# EAGLE design fat2 (EAGLE 6.1)
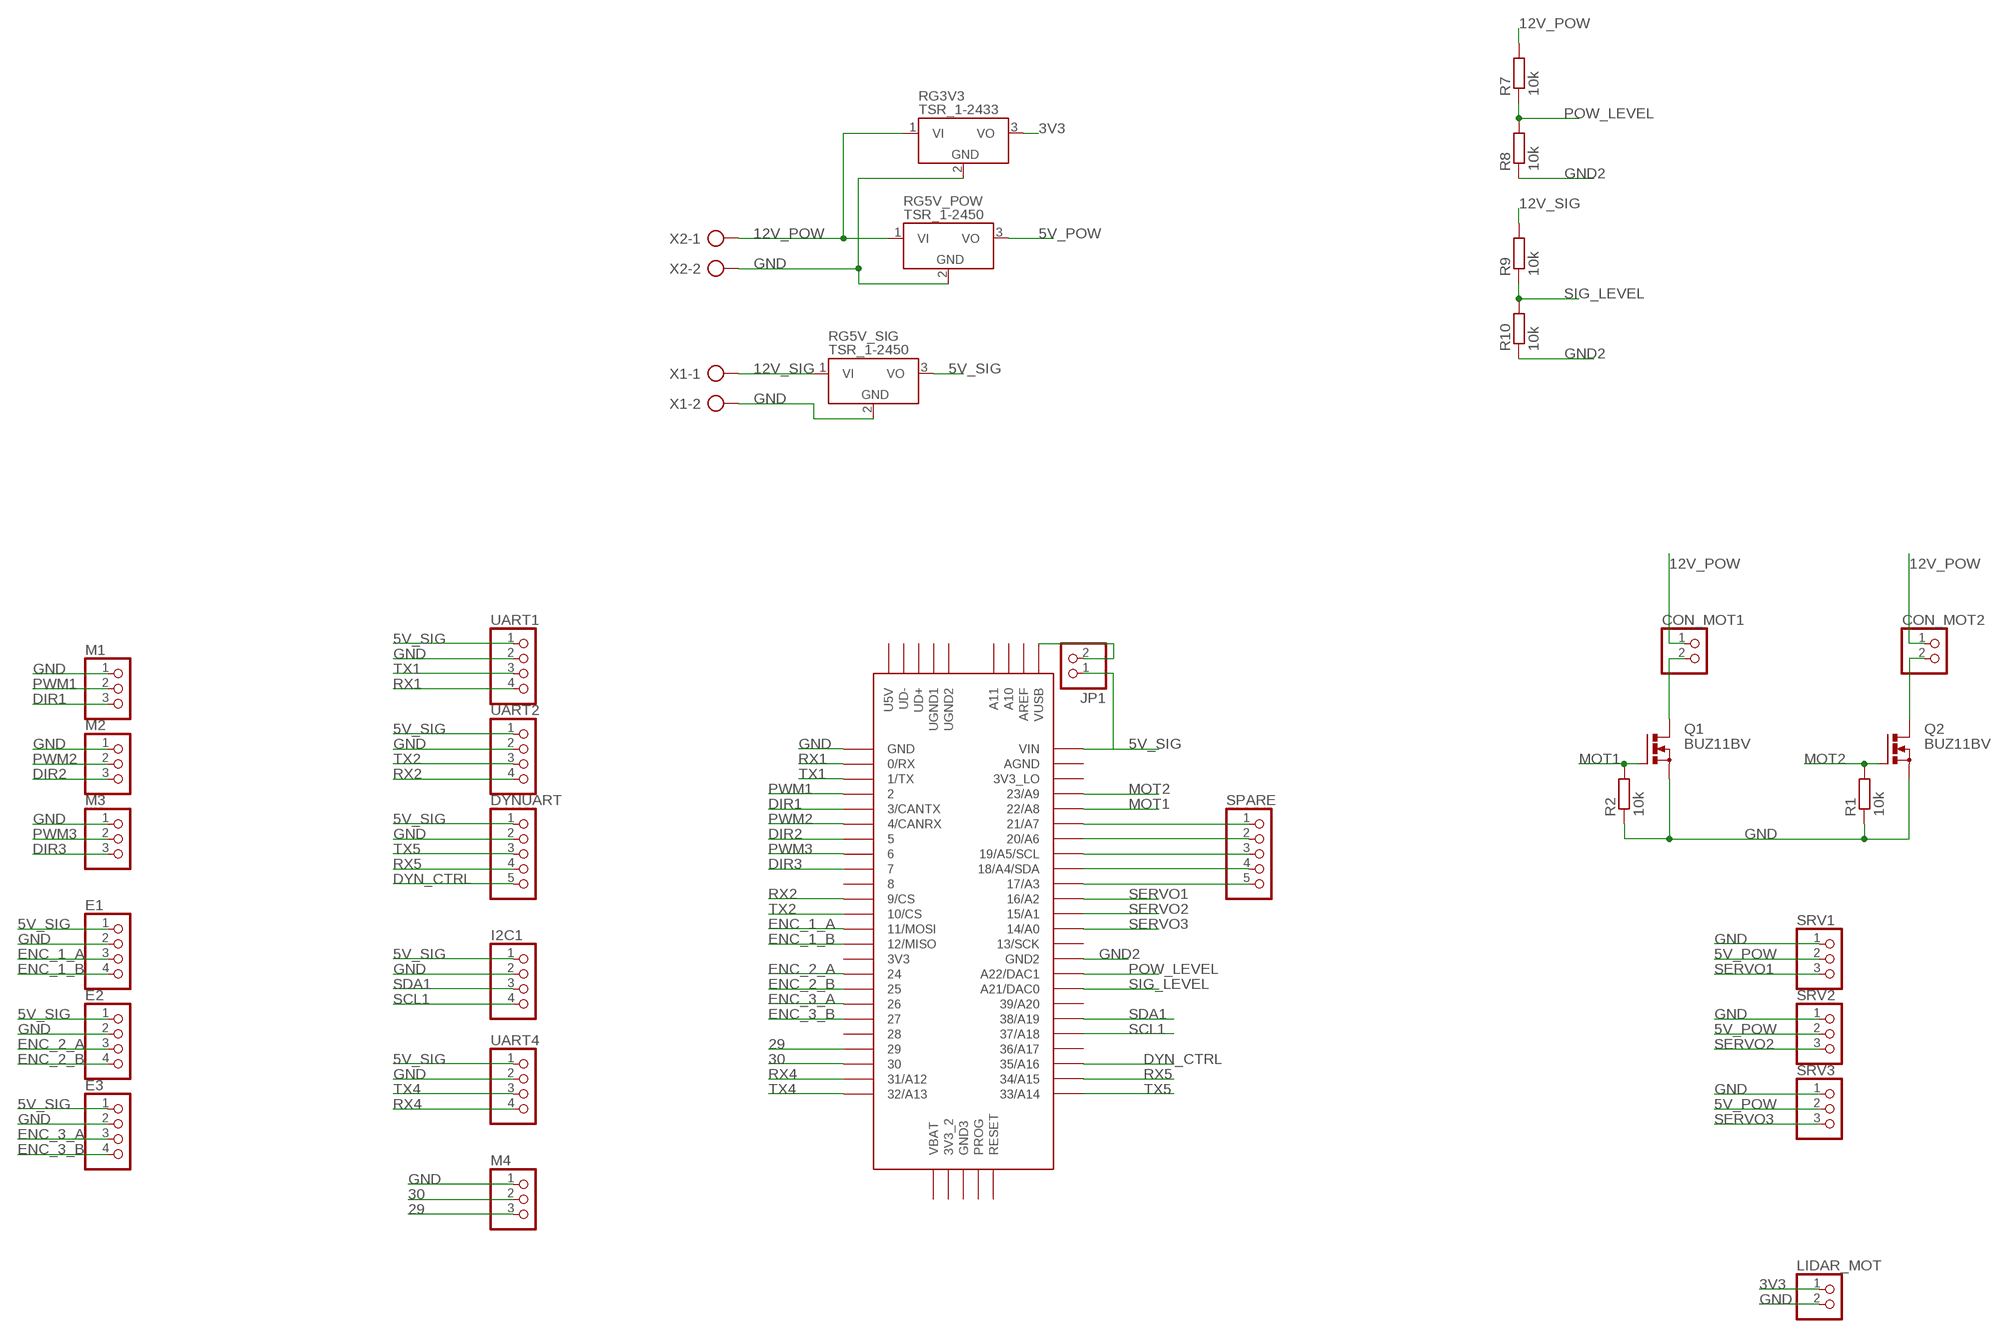
[diagram p0: schematic, sheet 1]

## Parts
CON_MOT1  PINHD-1X2  [1X02]
CON_MOT2  PINHD-1X2  [1X02]
DYNUART  PINHD-1X5  [1X05]
E1  PINHD-1X4  [1X04]
E2  PINHD-1X4  [1X04]
E3  PINHD-1X4  [1X04]
I2C1  PINHD-1X4  [1X04]
JP1  PINHD-1X2/90  [1X02/90]
LIDAR_MOT  PINHD-1X2  [1X02]
M1  PINHD-1X3  [1X03]
M2  PINHD-1X3  [1X03]
M3  PINHD-1X3  [1X03]
M4  PINHD-1X3  [1X03]
Q1  BUZ11BV  [TO220BV]
Q2  BUZ11BV  [TO220BV]
R1  10k  R-EU_0204/7  [0204/7]
R2  10k  R-EU_0204/7  [0204/7]
R7  10k  R-EU_0204/7  [0204/7]
R8  10k  R-EU_0204/7  [0204/7]
R9  10k  R-EU_0204/7  [0204/7]
R10  10k  R-EU_0204/7  [0204/7]
RG3V3  TSR_1-2433  [TSR-1]
RG5V_POW  TSR_1-2450  [TSR-1]
RG5V_SIG  TSR_1-2450  [TSR-1]
SPARE  PINHD-1X5  [1X05]
SRV1  PINHD-1X3  [1X03]
SRV2  PINHD-1X3  [1X03]
SRV3  PINHD-1X3  [1X03]
U$1  TEENSY_3.5/3.6  [TEENSY_3.5/3.6]
UART1  PINHD-1X4  [1X04]
UART2  PINHD-1X4  [1X04]
UART4  PINHD-1X4  [1X04]
X1  AK300/2  [AK300/2]
X2  AK300/2  [AK300/2]

## Nets
3V3: LIDAR_MOT.1 RG3V3.3(VO)
5V_POW: RG5V_POW.3(VO) SRV1.2 SRV2.2 SRV3.2
5V_SIG: DYNUART.1 E1.1 E2.1 E3.1 I2C1.1 JP1.1 RG5V_SIG.3(VO) U$1.VIN UART1.1 UART2.1 UART4.1
12V_POW: CON_MOT1.1 CON_MOT2.1 R7.2 RG3V3.1(VI) RG5V_POW.1(VI) X2.1
12V_SIG: R9.2 RG5V_SIG.1(VI) X1.1
29: M4.3 U$1.29
30: M4.2 U$1.30
DIR1: M1.3 U$1.3/CANTX
DIR2: M2.3 U$1.5
DIR3: M3.3 U$1.7
DYN_CTRL: DYNUART.5 U$1.35/A16
ENC_1_A: E1.3 U$1.11/MOSI
ENC_1_B: E1.4 U$1.12/MISO
ENC_2_A: E2.3 U$1.24
ENC_2_B: E2.4 U$1.25
ENC_3_A: E3.3 U$1.26
ENC_3_B: E3.4 U$1.27
GND: DYNUART.2 E1.2 E2.2 E3.2 I2C1.2 LIDAR_MOT.2 M1.1 M2.1 M3.1 M4.1 Q1.S Q2.S R1.1 R2.1 RG3V3.2(GND) RG5V_POW.2(GND) RG5V_SIG.2(GND) SRV1.1 SRV2.1 SRV3.1 U$1.GND UART1.2 UART2.2 UART4.2 X1.2 X2.2
GND2: R8.1 R10.1 U$1.GND2
MOT1: Q1.G R2.2 U$1.22/A8
MOT2: Q2.G R1.2 U$1.23/A9
N$1: SPARE.5 U$1.17/A3
N$2: SPARE.4 U$1.18/A4/SDA
N$3: CON_MOT1.2 Q1.D
N$4: SPARE.3 U$1.19/A5/SCL
N$5: CON_MOT2.2 Q2.D
N$6: SPARE.2 U$1.20/A6
N$7: JP1.2 U$1.VUSB
N$8: SPARE.1 U$1.21/A7
POW_LEVEL: R7.1 R8.2 U$1.A22/DAC1
PWM1: M1.2 U$1.2
PWM2: M2.2 U$1.4/CANRX
PWM3: M3.2 U$1.6
RX1: U$1.0/RX UART1.4
RX2: U$1.9/CS UART2.4
RX4: U$1.31/A12 UART4.4
RX5: DYNUART.4 U$1.34/A15
SCL1: I2C1.4 U$1.37/A18
SDA1: I2C1.3 U$1.38/A19
SERVO1: SRV1.3 U$1.16/A2
SERVO2: SRV2.3 U$1.15/A1
SERVO3: SRV3.3 U$1.14/A0
SIG_LEVEL: R9.1 R10.2 U$1.21/DAC0(A21/DAC0)
TX1: U$1.1/TX UART1.3
TX2: U$1.10/CS UART2.3
TX4: U$1.32/A13 UART4.3
TX5: DYNUART.3 U$1.33/A14
Unconnected: U$1.3V3 U$1.3V3_2 U$1.3V3_LO U$1.8 U$1.13/SCK U$1.28 U$1.36/A17 U$1.39/A20 U$1.A10 U$1.A11 U$1.AGND U$1.AREF U$1.GND3 U$1.PROG U$1.RESET U$1.U5V U$1.UD+ U$1.UD- U$1.UGND1 U$1.UGND2 U$1.VBAT

## Library data of the parts
CON_MOT1 CON_MOT2 JP1 LIDAR_MOT = pinhead:PINHD-1X2: PIN HEADER
DYNUART SPARE = pinhead:PINHD-1X5: PIN HEADER
E1-E3 I2C1 UART1 UART2 UART4 = pinhead:PINHD-1X4: PIN HEADER
M1-M4 SRV1-SRV3 = pinhead:PINHD-1X3: PIN HEADER
Q1 Q2 = transistor-power:BUZ11: N-CHANNEL MOS FET
R1 R2 R7-R10 = rcl:R-EU_: RESISTOR, European symbol
RG3V3 RG5V_POW RG5V_SIG = _traco_tsr-1:TSR_1-*: TRACO TSR-1 Series Point-of-Load DC/DC-Converters Vi max. 36 V; Vo = (1.2 .. 15)V ±2%; Io = 0 .. 1 A SIP-Package (drop-in replacement for 78xx linear voltage regulators in TO220-package, vertically assembled) Source: www.tracopower.com Technologies: TSR 1- Vi (V) Vo (V) ±2% Io = 0 .. 1 A 24_ ( generic ) 2412 4.6 .. 36 1.2 2415 4.6 .. 36 1.5 2418 4.6 .. 36 1.8 2425 4.6 .. 36 2.5 2433 4.75.. 36 3.3 2450 6.5 .. 36 5.0 2465 9.0 .. 36 6.5 2490 12 .. 36 9.0 24120 15 .. 36 12 24150 18 .. 36 15 Author: Dipl.-Ing. FH Rainer Bayer HHN Hochschule Heilbronn, rainer.bayer@hs-heilbronn.de Ingenieurbüro ing-rb, mail@ing-rb.de
U$1 = Teensy356:TEENSY_3.5/3.6
X1 X2 = con-ptr500:AK300/2: CONNECTOR; OC_FARNELL: unknown; OC_NEWARK: unknown

## Board
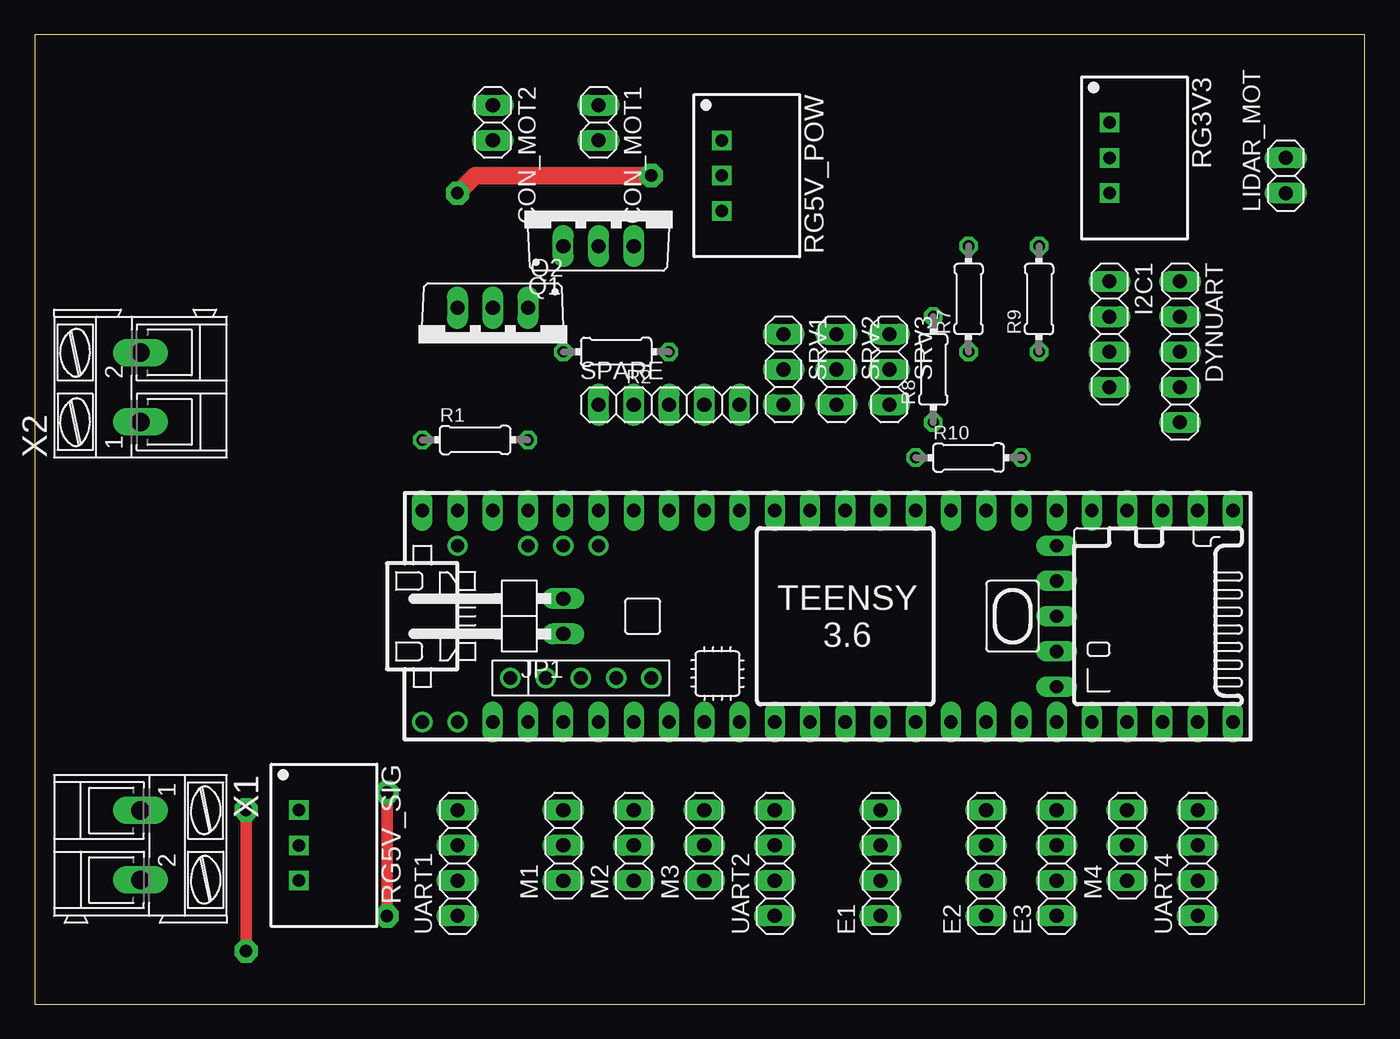
[diagram p1: board, top side]
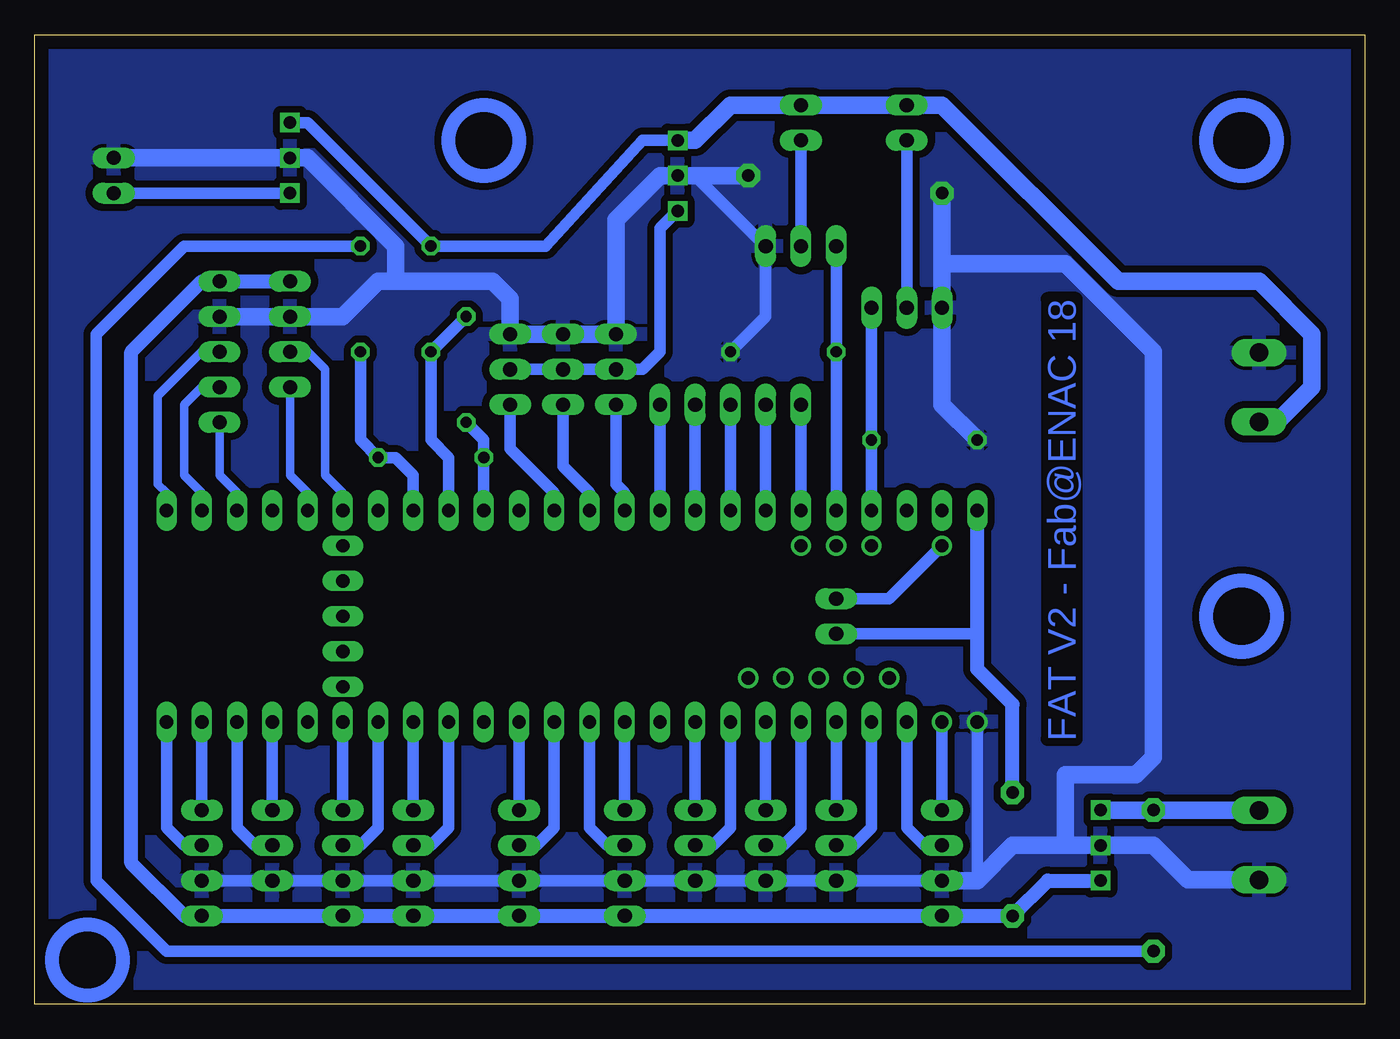
[diagram p2: board, bottom side, seen from below]

Size 95.87 x 69.84 mm. Coordinates in mm from the lower left corner, seen from the top.
Outline: 0,0 95.87,0 95.87,69.84 0,69.84 0,0
Copper layers (1*16): Top 0.035mm / dielectric 1.5mm / Bottom 0.035mm
Design rules: minimum track width 10mil, minimum drill 24mil, track to track 20mil, track to pad 20mil, pad to pad 8mil, via to via 8mil, smd to smd 8mil, copper to edge 40mil, drill to drill 8mil, minimum pad ring 10mil, minimum via ring 8mil, stop-mask expansion 4mil, vias tented up to drill 0mil, thermal gap 10mil

### Footprints (pad centres in the part's own frame; a part is rotated, then mirrored left to right if it is on the bottom)
1X02 = drill 1.016 long: 1 -1.27,0; 2 1.27,0
1X05 = drill 1.016 long: 1 -5.08,0; 2 -2.54,0; 3 0,0; 4 2.54,0; 5 5.08,0
1X04 = drill 1.016 long: 1 -3.81,0; 2 -1.27,0; 3 1.27,0; 4 3.81,0
1X02/90 = drill 1.016 long: 1 -1.27,-3.81; 2 1.27,-3.81
1X03 = drill 1.016 long: 1 -2.54,0; 2 0,0; 3 2.54,0
TO220BV = drill 1.016 long: D 0,-2.54; G -2.54,-2.54; S 2.54,-2.54
0204/7 = drill 0.813 octagon: 1 -3.81,0; 2 3.81,0
TSR-1 = drill 0.9 square: 1 -2.54,0; 2 0,0; 3 2.54,0
TEENSY_3.5/3.6 = drill 0.965 pad 1.422: 0/RX -25.4,-7.62; A10 -17.78,5.08; A11 -15.24,5.08; AREF -20.32,5.08; GND -27.94,-7.62; U5V -21.59,-4.445; UD+ -16.51,-4.445; UD- -19.05,-4.445; UGND1 -13.97,-4.445; UGND2 -11.43,-4.445; VUSB -25.4,5.08 | drill 0.965 pad 1.27 long: 1/TX -22.86,-7.62; 2 -20.32,-7.62; 3/CANTX -17.78,-7.62; 3V3 7.62,-7.62; 3V3_LO -22.86,7.62; 4/CANRX -15.24,-7.62; 5 -12.7,-7.62; 6 -10.16,-7.62; 7 -7.62,-7.62; 8 -5.08,-7.62; 9/CS -2.54,-7.62; 10/CS 0,-7.62; 11/MOSI 2.54,-7.62; 12/MISO 5.08,-7.62; 13/SCK 5.08,7.62; 14/A0 2.54,7.62; 15/A1 0,7.62; 16/A2 -2.54,7.62; 17/A3 -5.08,7.62; 18/A4/SDA -7.62,7.62; 19/A5/SCL -10.16,7.62; 20/A6 -12.7,7.62; 21/A7 -15.24,7.62; 21/DAC0 12.7,7.62; 22/A8 -17.78,7.62; 23/A9 -20.32,7.62; 24 10.16,-7.62; 25 12.7,-7.62; 26 15.24,-7.62; 27 17.78,-7.62; 28 20.32,-7.62; 29 22.86,-7.62; 30 25.4,-7.62; 31/A12 27.94,-7.62; 32/A13 30.48,-7.62; 33/A14 30.48,7.62; 34/A15 27.94,7.62; 35/A16 25.4,7.62; 36/A17 22.86,7.62; 37/A18 20.32,7.62; 38/A19 17.78,7.62; 39/A20 15.24,7.62; A22/DAC1 10.16,7.62; AGND -25.4,7.62; GND2 7.62,7.62; RESET 17.78,5.08; VBAT 17.78,-5.08; VIN -27.94,7.62 | drill 0.965 long: 3V3_2 17.78,-2.54; GND3 17.78,0; PROG 17.78,2.54
AK300/2 = drill 1.321 long: 1 -2.515,0; 2 2.489,0

### Placement (x,y rotation side)
CON_MOT1  40.64,63.5 270 top
CON_MOT2  33.02,63.5 270 top
DYNUART  82.55,46.99 270 top
E1  60.96,10.16 90 top
E2  68.58,10.16 90 top
E3  73.66,10.16 90 top
I2C1  77.47,48.26 270 top
JP1  34.29,27.94 90 top
LIDAR_MOT  90.17,59.69 90 top
M1  38.1,11.43 90 top
M2  43.18,11.43 90 top
M3  48.26,11.43 90 top
M4  78.74,11.43 90 top
Q1  40.64,57.15 0 top
Q2  33.02,47.62 180 top
R1  31.75,40.64 0 top
R2  41.91,46.99 180 top
R7  67.31,50.8 90 top
R8  64.77,45.72 90 top
R9  72.39,50.8 90 top
R10  67.31,39.37 0 top
RG3V3  77.47,60.96 270 top
RG5V_POW  49.53,59.69 270 top
RG5V_SIG  19.05,11.43 270 top
SPARE  45.72,43.18 0 top
SRV1  53.98,45.72 270 top
SRV2  57.78,45.72 270 top
SRV3  61.59,45.72 270 top
U$1  55.88,27.94 0 top
UART1  30.48,10.16 90 top
UART2  53.34,10.16 90 top
UART4  83.82,10.16 90 top
X1  7.62,11.43 270 top
X2  7.62,44.45 90 top

### Tracks (layer width: path | path; a pad name or v marks a point on that pad's centre or on a via)
3V3
  Bottom 0.813: LIDAR_MOT.1 RG3V3.3
5V_POW
  Bottom 0.813: SRV3.2 SRV2.2 SRV1.2 52.07,45.72 50.8,46.99 50.8,55.88 RG5V_POW.3
5V_SIG  (via drill 0.9 pad 1.68)
  Top 0.813: v25.4,6.35 v25.4,15.24
  Bottom 0.61: UART2.1 52.07,6.35
  Bottom 0.813: UART4.1 85.09,6.35 | 83.82,52.07 DYNUART.1 | JP1.1 27.94,26.67
  Bottom 1.016: UART4.1 E3.1 E2.1 E1.1 UART2.1 UART1.1 v25.4,6.35 22.86,8.89 RG5V_SIG.3 | DYNUART.1 I2C1.1 | 85.09,6.35 88.9,10.16 88.9,46.99 83.82,52.07 | v25.4,15.24 25.4,21.59 27.94,24.13 27.94,26.67 U$1.VIN
12V_POW
  Bottom 0.813: RG5V_POW.1 52.07,62.23 59.05,54.61 R7.2 76.2,63.5 RG3V3.1
  Bottom 1.27: X2.1 6.33,41.94 3.81,44.45 3.81,48.26 7.62,52.07 17.78,52.07 30.48,64.77 CON_MOT2.1 CON_MOT1.1 45.72,64.77 48.26,62.23 RG5V_POW.1
12V_SIG  (via drill 0.9 pad 1.68)
  Top 0.813: v15.24,3.81 v15.24,13.97
  Bottom 0.813: R9.2 85.09,54.61 91.44,48.26 91.44,8.89 86.36,3.81 v15.24,3.81 | v15.24,13.97 15.24,13.95
  Bottom 1.27: X1.1 15.24,13.95 17.75,13.95 RG5V_SIG.1
29
  Bottom 0.813: U$1.29 M4.3
30
  Bottom 0.61: 80.01,11.43 M4.2
  Bottom 0.813: U$1.30 81.28,12.7 80.01,11.43
DIR1
  Bottom 0.813: U$1.3/CANTX M1.3
DIR2
  Bottom 0.813: U$1.5 M2.3
DIR3
  Bottom 0.813: U$1.7 M3.3
DYN_CTRL
  Bottom 0.61: U$1.35/A16 81.28,36.83 82.55,38.1 DYNUART.5
ENC_1_A
  Bottom 0.61: 59.69,11.43 E1.3
  Bottom 0.813: U$1.11/MOSI 58.42,12.7 59.69,11.43
ENC_1_B
  Bottom 0.813: U$1.12/MISO E1.4
ENC_2_A
  Bottom 0.61: 67.31,11.43 E2.3
  Bottom 0.813: U$1.24 66.04,12.7 67.31,11.43
ENC_2_B
  Bottom 0.813: U$1.25 E2.4
ENC_3_A
  Bottom 0.61: 72.39,11.43 E3.3
  Bottom 0.813: U$1.26 71.12,12.7 72.39,11.43
ENC_3_B
  Bottom 0.813: U$1.27 E3.4
GND  (via drill 0.9 pad 1.68)
  Top 1.27: v30.48,58.42 31.75,59.69 v44.45,59.69
  Bottom 0.813: UART1.2 M1.1 M2.1 M3.1 UART2.2 E1.2 E2.2 E3.2 M4.1 UART4.2 | RG5V_POW.2 48.26,59.69 Q1.S 43.18,49.53 R2.1 | U$1.GND 27.94,8.89
  Bottom 1.27: DYNUART.2 I2C1.2 73.66,49.53 71.12,52.07 69.85,52.07 | X1.2 12.75,8.94 15.24,11.43 RG5V_SIG.2 21.59,11.43 | 69.85,52.07 62.87,52.07 61.59,50.8 SRV3.1 SRV2.1 SRV1.1 53.98,56.52 50.8,59.69 RG5V_POW.2 v44.45,59.69 | 69.85,52.07 69.85,54.61 76.2,60.96 RG3V3.2 LIDAR_MOT.2 | 30.48,53.34 Q2.S 30.48,43.18 R1.1 | 30.48,53.34 v30.48,58.42 | 21.59,11.43 21.59,16.51 16.51,16.51 15.24,17.78 15.24,46.99 21.59,53.34 30.48,53.34 | 21.59,11.43 25.4,11.43 27.94,8.89 UART1.2
  pour Bottom: 1.27,68.58 95.25,68.58 95.25,1.27 1.27,1.27
GND2
  Bottom 0.813: U$1.GND2 R10.1 63.5,40.64 R8.1
MOT1
  Bottom 0.813: U$1.22/A8 R2.2 Q1.G
MOT2
  Bottom 0.813: Q2.G R1.2 U$1.23/A9
N$1
  Bottom 0.813: SPARE.5 U$1.17/A3
N$2
  Bottom 0.813: U$1.18/A4/SDA SPARE.4
N$3
  Bottom 0.813: Q1.D CON_MOT1.2
N$4
  Bottom 0.813: SPARE.3 U$1.19/A5/SCL
N$5
  Bottom 0.813: Q2.D CON_MOT2.2
N$6
  Bottom 0.813: U$1.20/A6 SPARE.2
N$7
  Bottom 0.813: U$1.VUSB 34.29,29.21 JP1.2
N$8
  Bottom 0.813: SPARE.1 U$1.21/A7
POW_LEVEL
  Bottom 0.813: U$1.A22/DAC1 66.04,39.37 67.31,40.64 R7.1 R8.2
PWM1
  Bottom 0.61: 36.83,11.43 M1.2
  Bottom 0.813: U$1.2 35.56,12.7 36.83,11.43
PWM2
  Bottom 0.61: 41.91,11.43 M2.2
  Bottom 0.813: U$1.4/CANRX 40.64,12.7 41.91,11.43
PWM3
  Bottom 0.61: 46.99,11.43 M3.2
  Bottom 0.813: U$1.6 45.72,12.7 46.99,11.43
RX1
  Bottom 0.813: U$1.0/RX UART1.4
RX2
  Bottom 0.813: U$1.9/CS UART2.4
RX4
  Bottom 0.813: U$1.31/A12 UART4.4
RX5
  Bottom 0.61: U$1.34/A15 83.82,36.83 85.09,38.1 85.09,43.18 83.82,44.45 DYNUART.4
SCL1
  Bottom 0.61: U$1.37/A18 76.2,36.83 77.47,38.1 I2C1.4
SDA1
  Bottom 0.61: I2C1.3 76.2,46.99 74.93,45.72 74.93,38.1 73.66,36.83 U$1.38/A19
SERVO1
  Bottom 0.813: U$1.16/A2 53.34,36.83 53.98,37.47 SRV1.3
SERVO2
  Bottom 0.813: U$1.15/A1 55.88,36.83 57.78,38.73 SRV2.3
SERVO3
  Bottom 0.813: U$1.14/A0 58.42,36.83 61.59,40.01 SRV3.3
SIG_LEVEL
  Bottom 0.813: U$1.21/DAC0 68.58,38.1 69.85,39.37 R10.2 72.39,40.64 R9.1
TX1
  Bottom 0.61: 31.75,11.43 UART1.3
  Bottom 0.813: U$1.1/TX 33.02,12.7 31.75,11.43
TX2
  Bottom 0.61: 54.61,11.43 UART2.3
  Bottom 0.813: U$1.10/CS 55.88,12.7 54.61,11.43
TX4
  Bottom 0.61: 85.09,11.43 UART4.3
  Bottom 0.813: U$1.32/A13 86.36,12.7 85.09,11.43
TX5
  Bottom 0.61: U$1.33/A14 86.36,36.83 87,37.47 87,43.81 83.82,46.99 DYNUART.3
(copper drawn outside any net)
  shapes: Bottom circle x4

### Text on the board
Bottom: FAT V2 - Fab@ENAC 18